# Altium project Acoustics_Preamp.PrjPcb
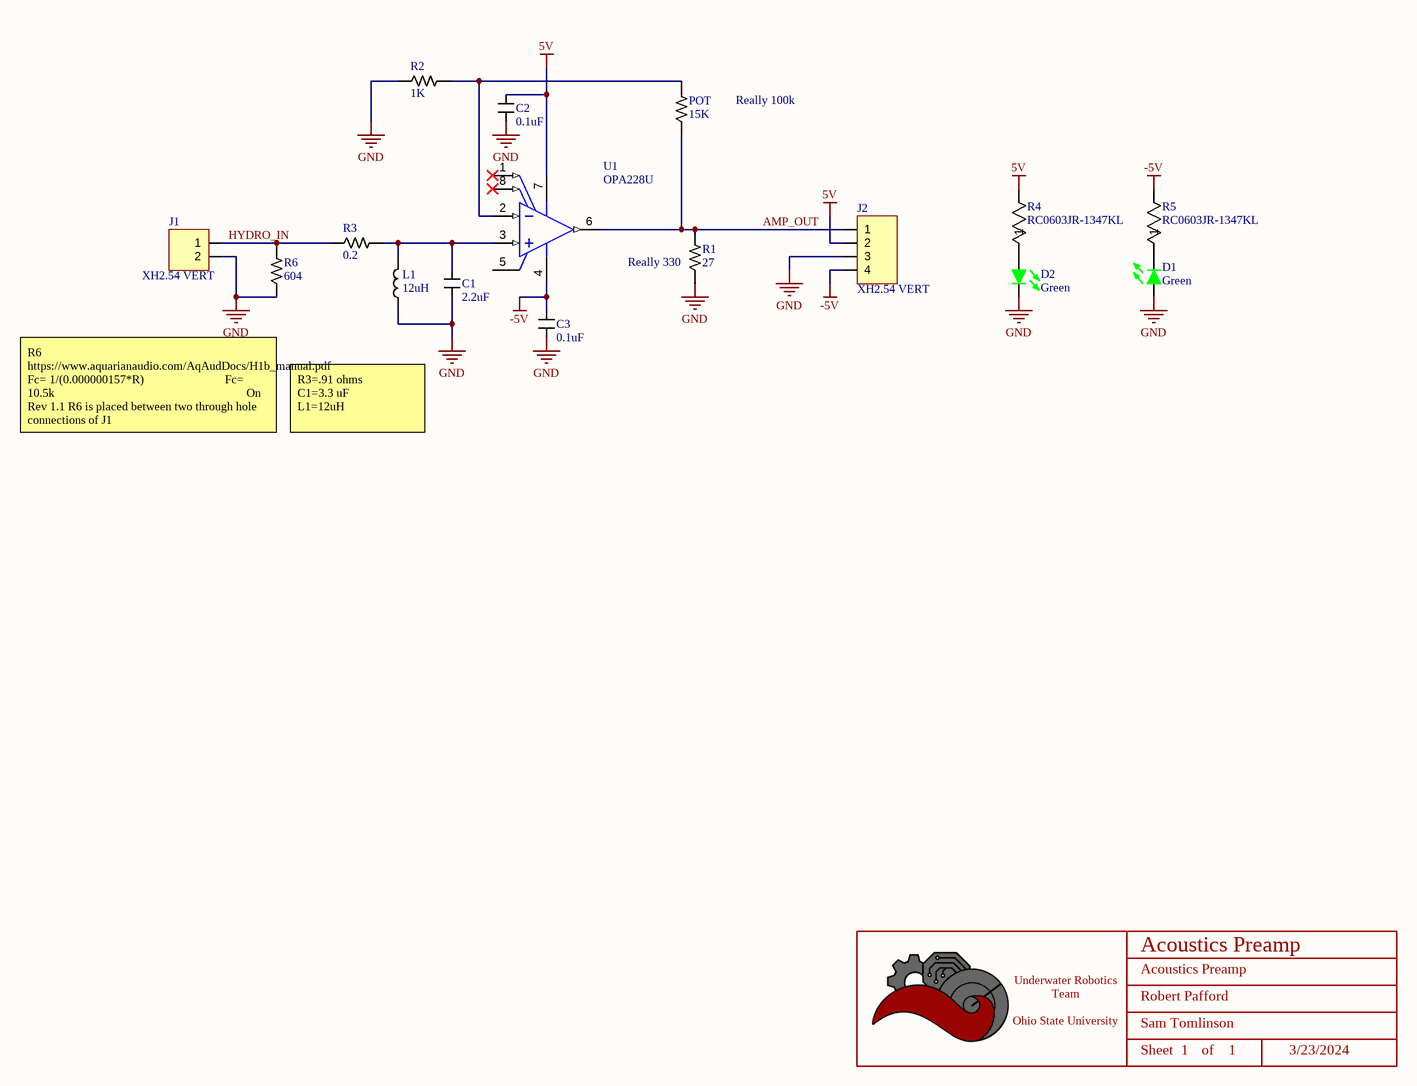
[diagram p0: Acoustics_Preamp.SchDoc]
BoardRevision: 1.0; DateOfDesignReview: XX/XX/XXXX; ProjectTitle: Acoustics Preamp; TeamLead: Sam Tomlinson
1 sheet, 17 parts. Net scope: global (net labels, ports and power ports of the same name join across sheets).
Board file: Acoustics_Preamp.PcbDoc

## Sheet Acoustics_Preamp.SchDoc: Acoustics Preamp
size B; Date: 3/23/2024; Author: Robert Pafford; Organization: ORGANIZATION; Address1: ADDRESS 1; Address2: ADDRESS 2; Address3: ADDRESS 3; Address4: ADDRESS 4; Revision: -; SheetNumber: 1; SheetTotal: 1; ENG_APP_DATE: --/--/--; DSN_APP_DATE: --/--/--; CHK_APP_DATE: --/--/--

### Parts
*  Title_Block  [LOGO]  (value not drawn)  (graphical)
C1  value 2.2uF  [CAPACITOR_0603]  (hidden comment: 22uF Ceramic)
C2  value 0.1uF  [CAPACITOR_0603]  (hidden comment: 100nF Ceramic 25V)
C3  value 0.1uF  [CAPACITOR_0603]  (hidden comment: 100nF Ceramic 25V)
D1  Color: Green  [LED_0603]  (hidden comment: 150060GS75000)
D2  Color: Green  [LED_0603]  (hidden comment: 150060GS75000)
J1  XH2.54 VERT  [CONN_JST_XH254_2POS_VERT]
J2  XH2.54 VERT  [CONN_JST_XH254_4POS_VERT]
L1  value 12uH  [INDUCTOR_0603]  (hidden comment: FIXED IND 12UH 10MA 1.8 OHM SMD)
POT  Value  (Ohms): 15K  [RESISTOR_0603]  (hidden comment: 15k Ohm 5% 1/10W)
R1  Value  (Ohms): 27  [RESISTOR_0603]  (hidden comment: 27 Ohm 5% 1/8W)
R2  Value  (Ohms): 1K  [RESISTOR_0603]  (hidden comment: 1k Ohm 5% 1/8W)
R3  Value  (Ohms): 0.2  [RESISTOR_0603]  (hidden comment: 0.2 Ohm 5% 1/8W)
R4  RC0603JR-1347KL  [RESISTOR_0603]
R5  RC0603JR-1347KL  [RESISTOR_0603]
R6  Value  (Ohms): 604  [RESISTOR_0402]  (hidden comment: 604 Ohm 1% 1/16W)
U1  OPA228U  [D0008A_M]

### Nets
5V: C2.1 J2.2 R4.2 U1.7(V+)
-5V: C3.1 J2.4 R5.2 U1.4(V-)
GND: C1.2 C2.2 C3.2 D1.1 D2.2 J1.2 J2.3 L1.2 R1.2 R2.2 R6.2
AMP_OUT: J2.1 POT.2 R1.1 U1.6(OUT)
HYDRO_IN: J1.1 R3.2 R6.1
NetC1_1: C1.1 L1.1 R3.1 U1.3(IN+)
NetD1_2: D1.2 R5.1
NetD2_1: D2.1 R4.1
NetPOT_1: POT.1 R2.1 U1.2(IN-)

Not connected (* = marked no-connect by the designer): U1 1(TRIM)* 5(NC) 8(TRIM)*

### Notes on the sheet
- Really 100k
- (near R1) Really 330
- R6                                    https://www.aquarianaudio.com/AqAudDocs/H1b_manual.pdf    Fc= 1/(0.000000157*R)                           Fc= 10.5k                                                                On Rev 1.1 R6 is placed between two through hole connections of J1
- R3=.91 ohms                                                         C1=3.3 uF                                                           L1=12uH
- DWG. NO.
- REV.
- SHT.
- THIS DOCUMENT AND THE DATA DISCLOSED HEREIN OR HEREWITH IS THE PROPERTY OF ALTIUM LIMITED AND MAY BE FREELY DISTRIBUTED IN WHOLE. NO RIGHTS ARE RESERVED OR EXPRESS OR IMPLIED WARANTEE GIVEN.
- REVISION
- DESCRIPTION
- DATE
- APPROVED
- ENG:
- APPROVALS
- PROJECT
- DSN:
- CHK:
- REFERENCE DOCUMENTS
- PROJECT REVISION:
- TITLE
- DOCUMENT REVISION:
- DESIGN ITEM:
- BOM:
- FAB DWG:
- PCB DWG:
- ASSY DWG:
- SCALE:
- SIZE
- B
- CAGE CODE
- FILE NAME
- DWG NO.
- SHEET
- OF
- REV
- (in symbol Title_Block) Underwater Robotics Team / Ohio State University; Sheet; of

### Library data of the parts
* = Title_Block: UWRT Schematic Title Block Template / Created June 2021, Dylan Trainor
C1 = CAPACITOR_22uF_0603: CAP CER 2.2PF 50V C0G/NP0 0603; Tolerance: +/- 20%; Voltage: 6.3V; Made By: Flip B; Supplier 1: Digi-Key; Supplier Part Number 1: 445-8028-1-ND
C2 C3 = CAPACITOR_0.1uF_0603_25V: Cap 100nF 25V +/-10% / Ceramic 0603; Voltage: 6.3V; Made By: Flip B; ComponentLink1Description: Datsheet; ComponentLink1URL: https://www.mouser.com/datasheet/2/212/KEM_C1002_X7R_SMD-1102033.pdf; Tolerance: +/- 10%; Supplier 1: Digikey; Supplier Part Number 1: 1276-1006-1-ND
D1 D2 = LED_Green_0603_3.2V: LED Green Vf= 3.2V If = 0.025A / 150060GS75000; Made By: Flip B; Forward Current: 25mA; Supplier 1: Digi-Key; ComponentLink1Description: Datasheet; ComponentLink1URL: https://www.we-online.de/katalog/datasheet/150060GS75000.pdf; Supplier Part Number 1: 732-4971-1-ND; Forward Voltage: 3.2V; Package: 0603
J1 = CONN_JST_XH254_2POS_VERT: JST XH 2.54mm Pitch 2 Pos Vertical; Current Per Pin: 4A; Number of Positions: 2; NOTE: Do not use JST 2.5mm parts with this footprint. JST does not make 2.54mm pitch pins, rather only clones make this connector!; Manufacturer: JST; Pitch: 2.54mm; Configuration: Vertical; Color: White; Created By: Robert P; Series: XH 2.54; ComponentLink1Description: Purchase Link; ComponentLink1URL: https://www.amazon.com/460PCS-XH2-54-Connector-Terminal-Connectors/dp/B09DBGVX5C
J2 = CONN_JST_XH254_4POS_VERT: JST XH 2.54mm Pitch 4 Pos Vertical; Current Per Pin: 4A; Number of Positions: 4; NOTE: Do not use JST 2.5mm parts with this footprint. JST does not make 2.54mm pitch pins, rather only clones make this connector!; Manufacturer: JST; Pitch: 2.54mm; Configuration: Vertical; Color: White; Created By: Robert P; Series: XH 2.54; ComponentLink1Description: Purchase Link; ComponentLink1URL: https://www.amazon.com/460PCS-XH2-54-Connector-Terminal-Connectors/dp/B09DBGVX5C
L1 = INDUCTOR_12uH_0603: 12 µH Shielded Multilayer Inductor 10 mA 1.8Ohm Max 0603 (1608 Metric); Tolerance: +/- 20%; Made By: Robert Pafford; DC Resistance: 36mOhm; Current Rating: 2.1A; Supplier 1: Arrow Electronics; Supplier Part Number 1: MLF1608E120JTD25
POT = RESISTOR_15K_0603: RES 15k OHM 5% 1/10W 0603; Tolerance: +/- 5%; Wattage: 1/8W; Made By: Dylan Trainor; ComponentLink1Description: Datasheet; ComponentLink1URL: https://www.bourns.com/docs/product-datasheets/CRxxxxx.pdf; Supplier: Digikey; Digikey Part Numer: CR0603-JW-104ELFTR-ND; Supplier 1: Avnet; Supplier Part Number 1: RMCF0603JG15K0
R1 = RESISTOR_27_0603: RES 27 OHM 5% 1/8W 0603; Tolerance: +/- 5%; Made By: Robert Pafford; ComponentLink1Description: Datasheet; ComponentLink1URL: https://www.bourns.com/docs/product-datasheets/CRxxxxx.pdf; Wattage: 1/8W; Supplier: Digikey; Digikey Part Numer: CR0603-JW-104ELFTR-ND; Supplier 1: Digi-Key; Supplier Part Number 1: 2019-RK73B1JTTD270JCT-ND
R2 = RESISTOR_1K_0603: RES 1.8 OHM 5% 1/8W 0603; Tolerance: +/- 5%; Made By: Robert Pafford; ComponentLink1Description: Datasheet; ComponentLink1URL: https://www.bourns.com/docs/product-datasheets/CRxxxxx.pdf; Wattage: 1/8W; Supplier: Digikey; Digikey Part Numer: CR0603-JW-104ELFTR-ND; Supplier 1: Digi-Key; Supplier Part Number 1: 2019-RK73B1JTTD102JCT-ND
R3 = RESISTOR_0.2_0603: RES 0.2 OHM 5% 1/8W 0603; Tolerance: +/- 5%; Made By: Robert Pafford; ComponentLink1Description: Datasheet; ComponentLink1URL: https://www.bourns.com/docs/product-datasheets/CRxxxxx.pdf; Wattage: 1/8W; Supplier: Digikey; Digikey Part Numer: CR0603-JW-104ELFTR-ND; Supplier 1: Mouser; Supplier Part Number 1: 279-RLP73N1JR20JTD
R4 R5 = RC0603JR-1347KL: 47kohm 0603 1/10w; Mfr_Name: Yageo; Copyright: Copyright (C) 2024 Ultra Librarian. All rights reserved.; Manufacturer_Part_Number: RC0603JR-1347KL; RefDes: RefDes; Type: DEV; Supplier 1: Mouser; Supplier Part Number 1: 603-RC0603JR-1347KL
R6 = RESISTOR_604_0402: RES 604 OHM 1% 1/16W 0402; Tolerance: +/- 1%; Made By: Robert Pafford; Wattage: 1/16W; Supplier: Digikey; Digikey Part Numer: CR0603-JW-104ELFTR-ND; Supplier 1: Digi-Key; Supplier Part Number 1: 13-AC0402FR-07604RLCT-ND
U1 = CMP-0272-00518-3: High Precision, Low Noise Operational Amplifier, 5 to 36 V, -55 to 125 degC, 8-pin SOIC (D8), Green (RoHS & no Sb/Br); Manufacturer: Texas Instruments; Slew Rate(Typ)(V/us): 11; Sub Family: High Supply Voltage Amplifier (>=30V), Low Noise Amp (<=10nV/rtHz), Low Offset Voltage Amplifier (<=500uV), Precision Amplifier; Total Supply Voltage(Min)(+5V is 5, +/-5V is 10): 5; Vio (25C)(Max)(mV): 0.075; IIB(Max)(pA): 10000; Total Supply Voltage(Max)(+5V is 5, +/-5V is 10): 36; Number of Channels: 1; Offset Drift(Typ)(uV/C): 0.1; Packing: TUBE; CMRR(Min)(dB): 120; Rating: Catalog; GBW(Typ)(MHz): 33; Iq per channel(Max)(mA): 3.8; Eco-Plan: Green (RoHS & no Sb/Br); ComponentLink3URL: http://www.ti.com/litv/pdf/msoi002j; Code_JEDEC: MS-012; ComponentLink2Description: Datasheet; PackageReference: D0008A; Mounting Technology: Surface Mount; PackageDescription: 8-Pin Plastic Small Outline, Body 4.9 x 3.9 mm, Pitch 1.27 mm; PartNumber: OPA228U; PackageVersion: 4040047-3/M, 06/2011; DatasheetVersion: SBOS110A; ComponentLink3Description: Package Specification; ComponentLink1Description: Manufacturer URL; ComponentLink2URL: http://www.ti.com/lit/ds/symlink/opa228.pdf; ComponentLink1URL: http://www.ti.com/